# EAGLE schematic ZEROSTICK (EAGLE 9.6.2)

## Sheet 1 of 2
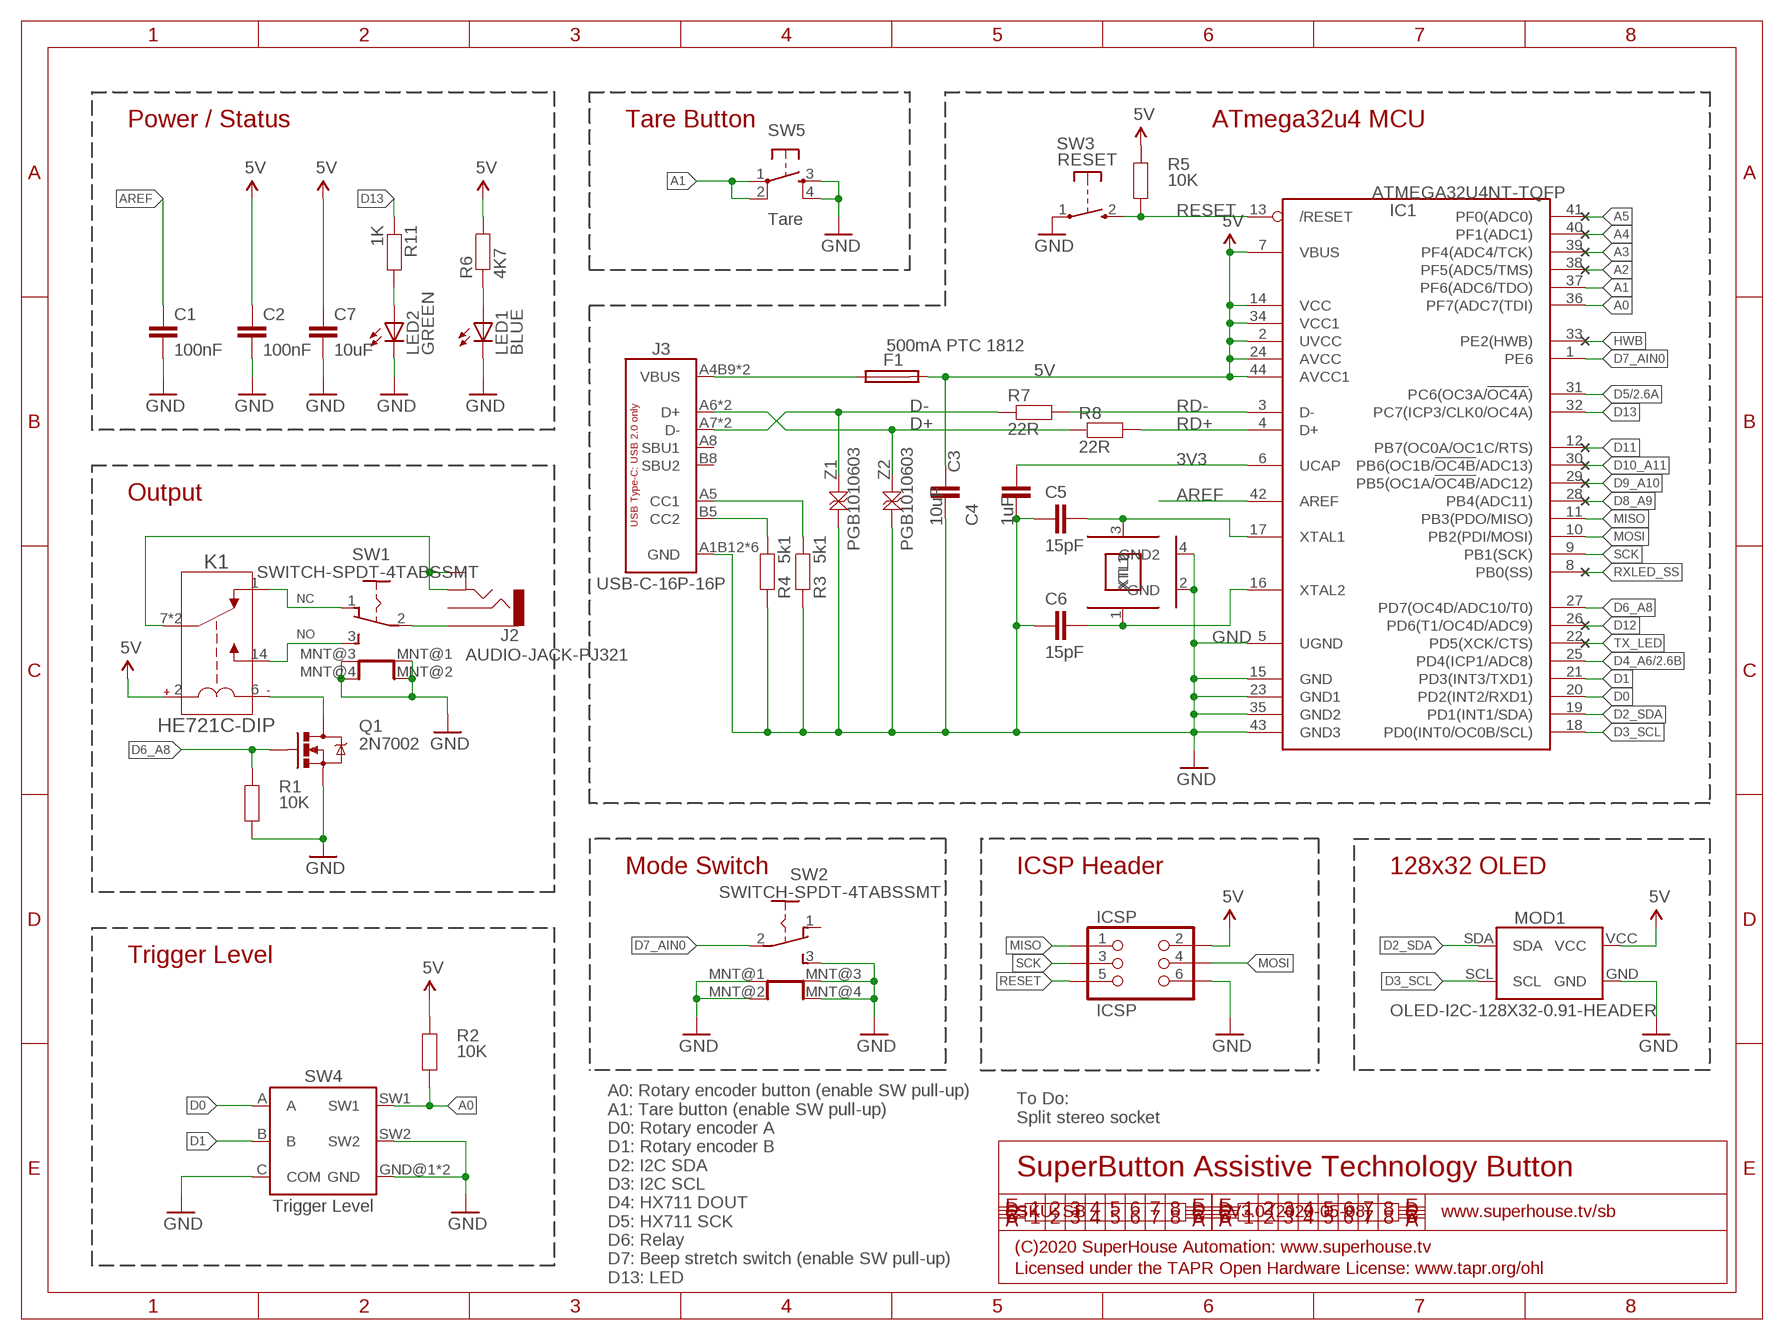
[diagram p0: schematic, sheet 1]

### Parts
C1  100nF  CAP0603  [C0603]
C2  100nF  CAP0603  [C0603]
C3  10uF  CAP0805  [C0805]
C4  1uF  CAP0603  [C0603]
C5  15pF  CAP0603  [C0603]
C6  15pF  CAP0603  [C0603]
C7  10uF  CAP0805  [C0805]
F1  500mA PTC 1812  PTC050  [1812]
IC1  ATMEGA32U4NT-TQFP  [TQFP44]
ICSP  ICSP  ICSP-PIN  [2X03-ICSP]
J2  AUDIO-JACK-PJ321  [AUDIO-JACK-PJ321]
J3  USB-C-16P-16P  [USB-C-16P]
K1  HE721C-DIP  [HE721]
LED1  BLUE  LED0603  [LED-0603]
LED2  GREEN  LED0603  [LED-0603]
MOD1  OLED-I2C-128X32-0.91-HEADER  [OLED-128X32-0.91-HEADER]
Q1  2N7002  MOSFET-NCHANNEL-233  [SOT23-3]
R1  10K  RESISTOR0603  [R0603]
R2  10K  RESISTOR0603  [R0603]
R3  5k1  RESISTOR0603  [R0603]
R4  5k1  RESISTOR0603  [R0603]
R5  10K  RESISTOR0603  [R0603]
R6  4K7  RESISTOR0603  [R0603]
R7  22R  RESISTOR0603  [R0603]
R8  22R  RESISTOR0603  [R0603]
R11  1K  RESISTOR0603  [R0603]
SW1  SWITCH-SPDT-4TABSSMT  [MK-12C02]
SW2  SWITCH-SPDT-4TABSSMT  [MK-12C02]
SW3  RESET  TAC_SWITCH_2PINSMT  [TACTILE_SMT_3X4X2]
SW4  Trigger Level  ENCODER  [PEC12R]
SW5  Tare  TAC_SWITCH-PTH-4.5  [TACTILE-PTH-4.5MM]
XTL1  16MHz  CRYSTAL-GND3X2  [CRYSTAL-SMD-3X2]
Z1  PGB1010603  TVS0603  [TVS0603]
Z2  PGB1010603  TVS0603  [TVS0603]

### Nets
3V3: C4.2 IC1.6(UCAP)
5V: C2.1 C3.1 C7.1 F1.2 IC1.2(UVCC) IC1.7(VBUS) IC1.14(VCC) IC1.24(AVCC) IC1.34(VCC1) IC1.44(AVCC1) ICSP.2 K1.2(COIL+) MOD1.VCC R2.2 R5.2 R6.2 ; also sheet 2
A0: IC1.36(PF7(ADC7(TDI)) R2.1 SW4.SW1
A1: IC1.37(PF6(ADC6/TDO)) SW5.1 SW5.2
A2: IC1.38(PF5(ADC5/TMS))
A3: IC1.39(PF4(ADC4/TCK))
A4: IC1.40(PF1(ADC1))
A5: IC1.41(PF0(ADC0))
AREF: C1.1 IC1.42(AREF)
D0: IC1.20(PD2(INT2/RXD1)) SW4.A
D1: IC1.21(PD3(INT3/TXD1)) SW4.B
D2_SDA: IC1.19(PD1(INT1/SDA)) MOD1.SDA
D3_SCL: IC1.18(PD0(INT0/OC0B/SCL)) MOD1.SCL
D4_A6: IC1.25(PD4(ICP1/ADC8)) ; also sheet 2
D5: IC1.31(PC6(OC3A/!OC4A!)) ; also sheet 2
D6_A8: IC1.27(PD7(OC4D/ADC10/T0)) Q1.1(G) R1.2
D7_AIN0: IC1.1(PE6) SW2.2(COM)
D8_A9: IC1.28(PB4(ADC11))
D9_A10: IC1.29(PB5(OC1A/!OC4B!/ADC12))
D10_A11: IC1.30(PB6(OC1B/!OC4B!/ADC13))
D11: IC1.12(PB7(OC0A/OC1C/RTS))
D12: IC1.26(PD6(T1/OC4D/ADC9))
D13: IC1.32(PC7(ICP3/CLK0/OC4A)) R11.1
D+: J3.A6(D+) J3.B6(D+) R8.1 Z2.2
D-: J3.A7(D-) J3.B7(D-) R7.1 Z1.2
GND: C1.2 C2.2 C3.2 C4.1 C5.1 C6.1 C7.2 IC1.5(UGND) IC1.15(GND) IC1.23(GND1) IC1.35(GND2) IC1.43(GND3) ICSP.6 J3.A1B12(GND) J3.A12B1(GND) J3.FIX1(GND) J3.FIX2(GND) J3.FIX3(GND) J3.FIX4(GND) LED1.C LED2.C MOD1.GND Q1.2(S) R1.1 R3.1 R4.1 SW1.MNT@1(MNT) SW1.MNT@2(MNT) SW1.MNT@3(MNT) SW1.MNT@4(MNT) SW2.3(B) SW2.MNT@1(MNT) SW2.MNT@2(MNT) SW2.MNT@3(MNT) SW2.MNT@4(MNT) SW3.1(P) SW4.C(COM) SW4.GND@1(GND) SW4.GND@2(GND) SW4.SW2 SW5.3 SW5.4 XTL1.2(GND) XTL1.4(GND2) Z1.1 Z2.1 ; also sheet 2
HWB: IC1.33(PE2(HWB))
MISO: IC1.11(PB3(PDO/MISO)) ICSP.1
MOSI: IC1.10(PB2(PDI/MOSI)) ICSP.4
N$1: LED2.A R11.2
N$3: K1.6(COIL-) Q1.3(D)
N$4: K1.14(NO) SW1.3(B)
N$5: LED1.A R6.1
N$6: K1.1(NC) SW1.1(A)
N$7: J2.4A J2.4B K1.7(COM) K1.8(COM)
N$9: J2.3 SW1.2(COM)
N$10: J3.B5(CC2) R4.2
N$11: C5.2 IC1.17(XTAL1) XTL1.3(XTL2)
N$12: C6.2 IC1.16(XTAL2) XTL1.1(XTL1)
N$13: J3.A5(CC1) R3.2
RD+: IC1.4(D+) R8.2
RD-: IC1.3(D-) R7.2
RESET: IC1.13(/RESET) ICSP.5 R5.1 SW3.2(S)
RXLED_SS: IC1.8(PB0(SS))
SCK: IC1.9(PB1(SCK)) ICSP.3
TX_LED: IC1.22(PD5(XCK/CTS))
USB+: F1.1 J3.A4B9(VBUS) J3.A9B4(VBUS)
Unconnected: J2.2 J3.A8(SBU1) J3.B8(SBU2) SW2.1(A)

### Notes on the sheet
- Power / Status | Tare Button | ATmega32u4 MCU
- Output
- NC
- NO
- Mode Switch | ICSP Header | 128x32 OLED
- Trigger Level
- To Do:
  Split stereo socket
- SuperButton Assistive Technology Button
- SKU: SB | V3.0 (2020-05-08) | www.superhouse.tv/sb
- (C)2020 SuperHouse Automation: www.superhouse.tv
- Licensed under the TAPR Open Hardware License: www.tapr.org/ohl
- A0: Rotary encoder button (enable SW pull-up)
  A1: Tare button (enable SW pull-up)
  D0: Rotary encoder A
  D1: Rotary encoder B
  D2: I2C SDA
  D3: I2C SCL
  D4: HX711 DOUT
  D5: HX711 SCK
  D6: Relay
  D7: Beep stretch switch (enable SW pull-up)
  D13: LED

## Sheet 2 of 2
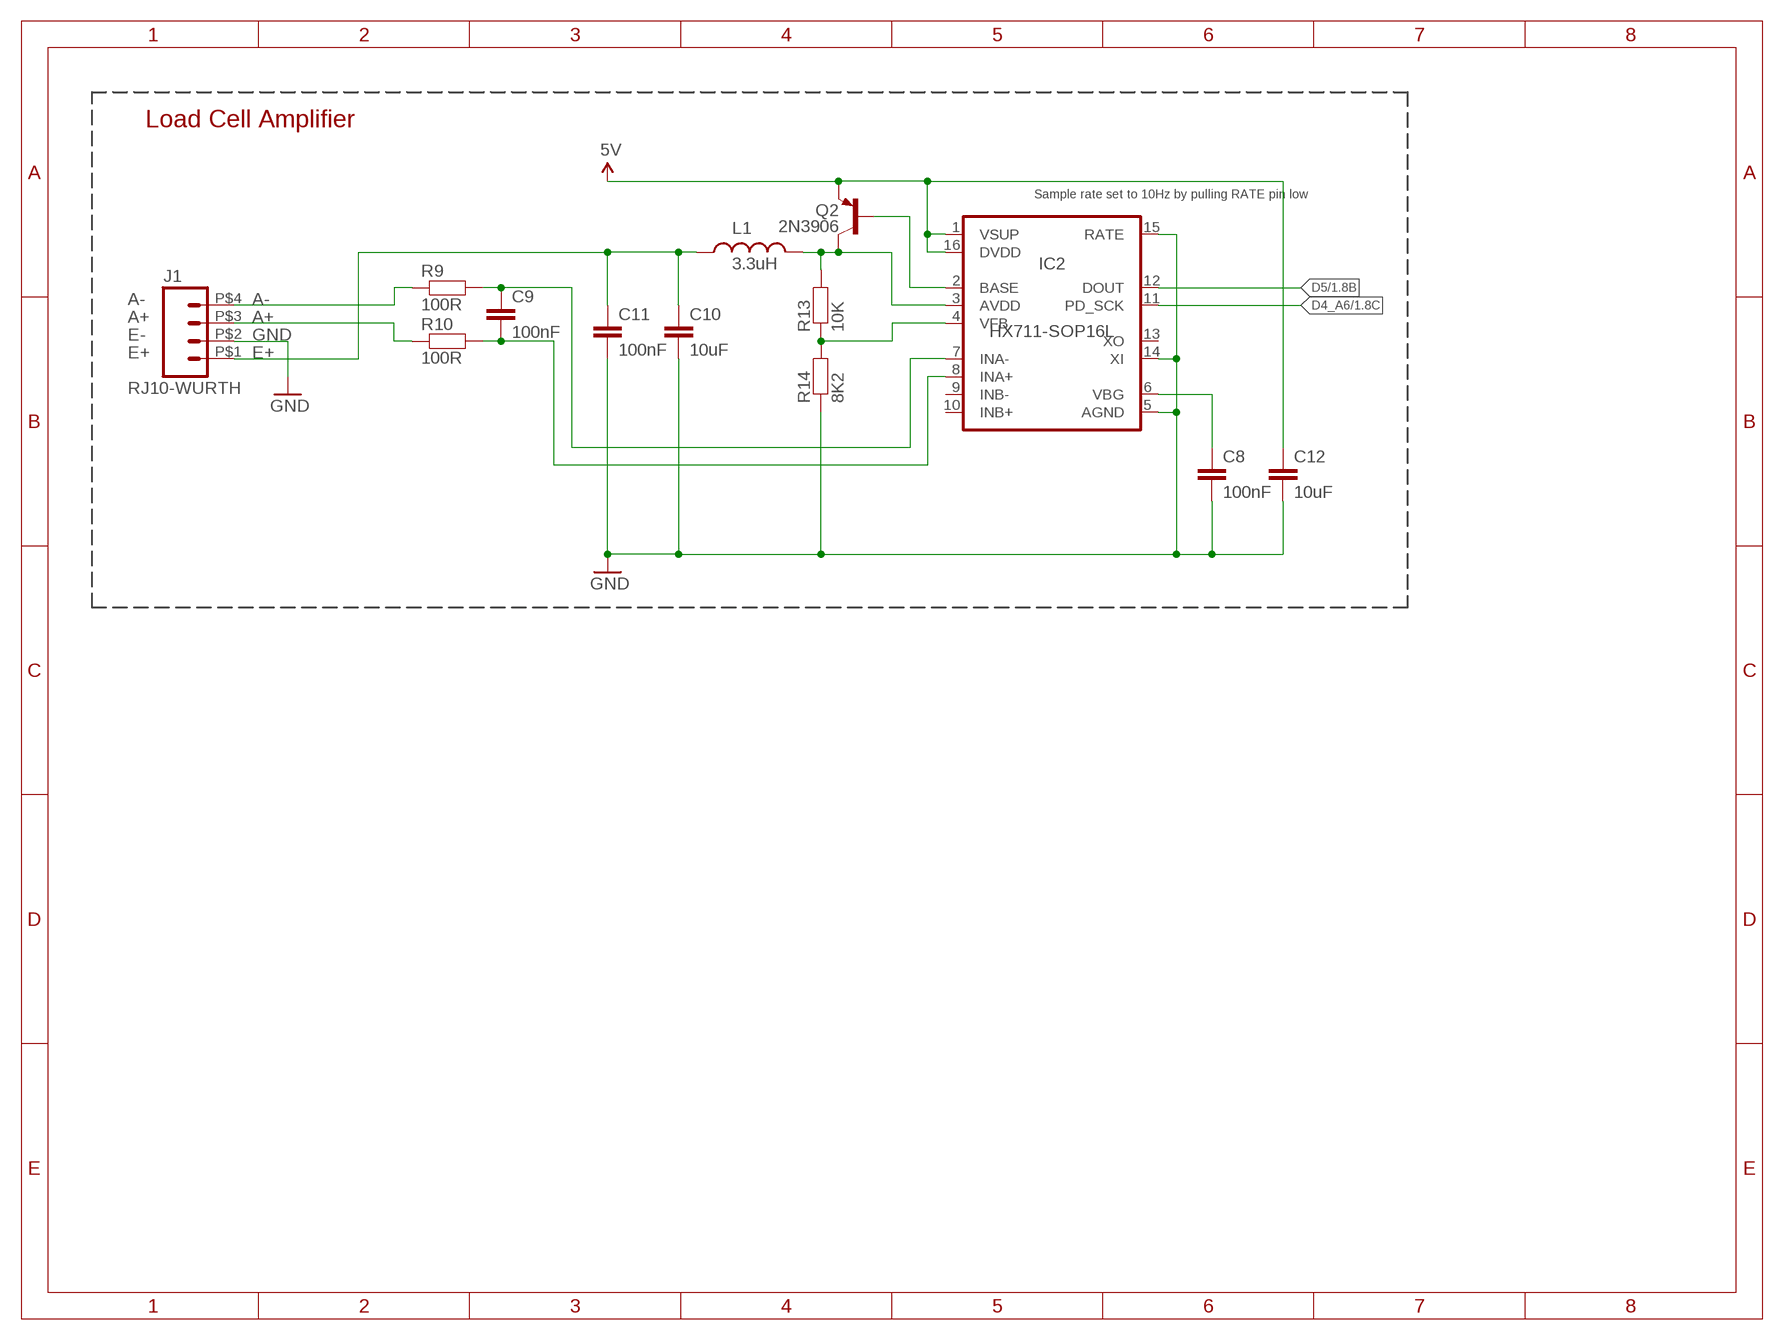
[diagram p1: schematic, sheet 2]

### Parts
C8  100nF  CAP0603  [C0603]
C9  100nF  CAP0603  [C0603]
C10  10uF  CAP0805  [C0805]
C11  100nF  CAP0603  [C0603]
C12  10uF  CAP0805  [C0805]
IC2  HX711-SOP16L  [SOP16-L]
J1  RJ10-WURTH  [RJ10]
L1  3.3uH  INDUCTOR0603  [L0603]
Q2  2N3906  TRANS_PNPMMBT3906LT1SOT23-BEC  [SOT23-BEC]
R9  100R  RESISTOR0603  [R0603]
R10  100R  RESISTOR0603  [R0603]
R13  10K  RESISTOR0603  [R0603]
R14  8K2  RESISTOR0603  [R0603]

### Nets
5V: C12.1 IC2.1(VSUP) IC2.16(DVDD) Q2.E ; also sheet 1
A+: J1.P$3 R10.1
A-: J1.P$4 R9.1
D4_A6: IC2.11(PD_SCK) ; also sheet 1
D5: IC2.12(DOUT) ; also sheet 1
E+: C10.1 C11.1 J1.P$1 L1.1
GND: C8.2 C10.2 C11.2 C12.2 IC2.5(AGND) IC2.14(XI) IC2.15(RATE) J1.P$2 R14.1 ; also sheet 1
N$14: C9.1 IC2.7(INA-) R9.2
N$15: C9.2 IC2.8(INA+) R10.2
N$16: IC2.3(AVDD) L1.2 Q2.C R13.2
N$17: C8.1 IC2.6(VBG)
N$20: IC2.2(BASE) Q2.B
N$21: IC2.4(VFB) R13.1 R14.2
Unconnected: IC2.9(INB-) IC2.10(INB+)

### Notes on the sheet
- Load Cell Amplifier
- Sample rate set to 10Hz by pulling RATE pin low
- A-
- A+
- E-
- E+

## Power pins joined to a net without a drawn wire
XO: IC2.13(XO)

## Library data of the parts
C1-C12 = SuperHouse-DiscreteSemi:CAP: Capacitor Standard ceramic capacitor
F1 = SuperHouse-Fuses:PTC: MF-SMDF Series - PRC Resettable Fuses Source: http://www.farnell.com/datasheets/716597.pdf
IC1 = SuperHouse-MCUs:ATMEGA32U4NT: ATmega32u4 MCU
IC2 = SuperHouse-ICs:HX711: HX711 strain gauge amplifier
ICSP = SuperHouse-Connectors:ICSP
J1 = SuperHouse-Connectors:RJ10: RJ10 jack (4P4C)
J2 = SuperHouse-Connectors:AUDIO-JACK-PJ321
J3 = SuperHouse-Connectors:USB-C-16P: USB-C socket with 16 pins, suitable only for backward compatibility with USB 2
K1 = SuperHouse-Relays:HE721C
L1 = SuperHouse-DiscreteSemi:INDUCTOR: Inductors Basic Inductor/Choke - 0603 and 1206. Footprints are not proven and vary greatly between part numbers.
LED1 LED2 = SuperHouse-LEDs:LED: LEDs Standard schematic elements and footprints for 5mm, 3mm, 1206, and 0603 sized LEDs. 5mm - Spark Fun Electronics SKU : COM-00529 (and others)
MOD1 = SuperHouse-Displays:OLED-I2C: OLED module with SSD1306 I2C driver
Q1 = SuperHouse-DiscreteSemi:MOSFET-NCHANNEL: N-channel MOSFET
Q2 = SuperHouse-DiscreteSemi:TRANS_PNP: PNP Transistror
R1-R11 R13 R14 = SuperHouse-DiscreteSemi:RESISTOR: Resistor Standard resistors.
SW1 SW2 = SuperHouse-Switches:SWITCH-SPDT-4TABS
SW3 = SuperHouse-Switches:TAC_SWITCH_2PIN: Momentary Tactile Switch - 2 pin Uxcell 3x4x2mm switch with 2 SMT pads
SW4 = SuperHouse-Switches:ENCODER: Rotary encoder with switch
SW5 = SuperHouse-Switches:TAC_SWITCH: Momentary Switch Tactile switch, normally-open.
XTL1 = SuperHouse-Oscillators:CRYSTAL-GND: 3x2mm SMT crystal
Z1 Z2 = SuperHouse-DiscreteSemi:TVS: TVS voltage protection Zener